# Altium schematic sheet ESP_SCH.SchDoc
size 381 x 177 mm
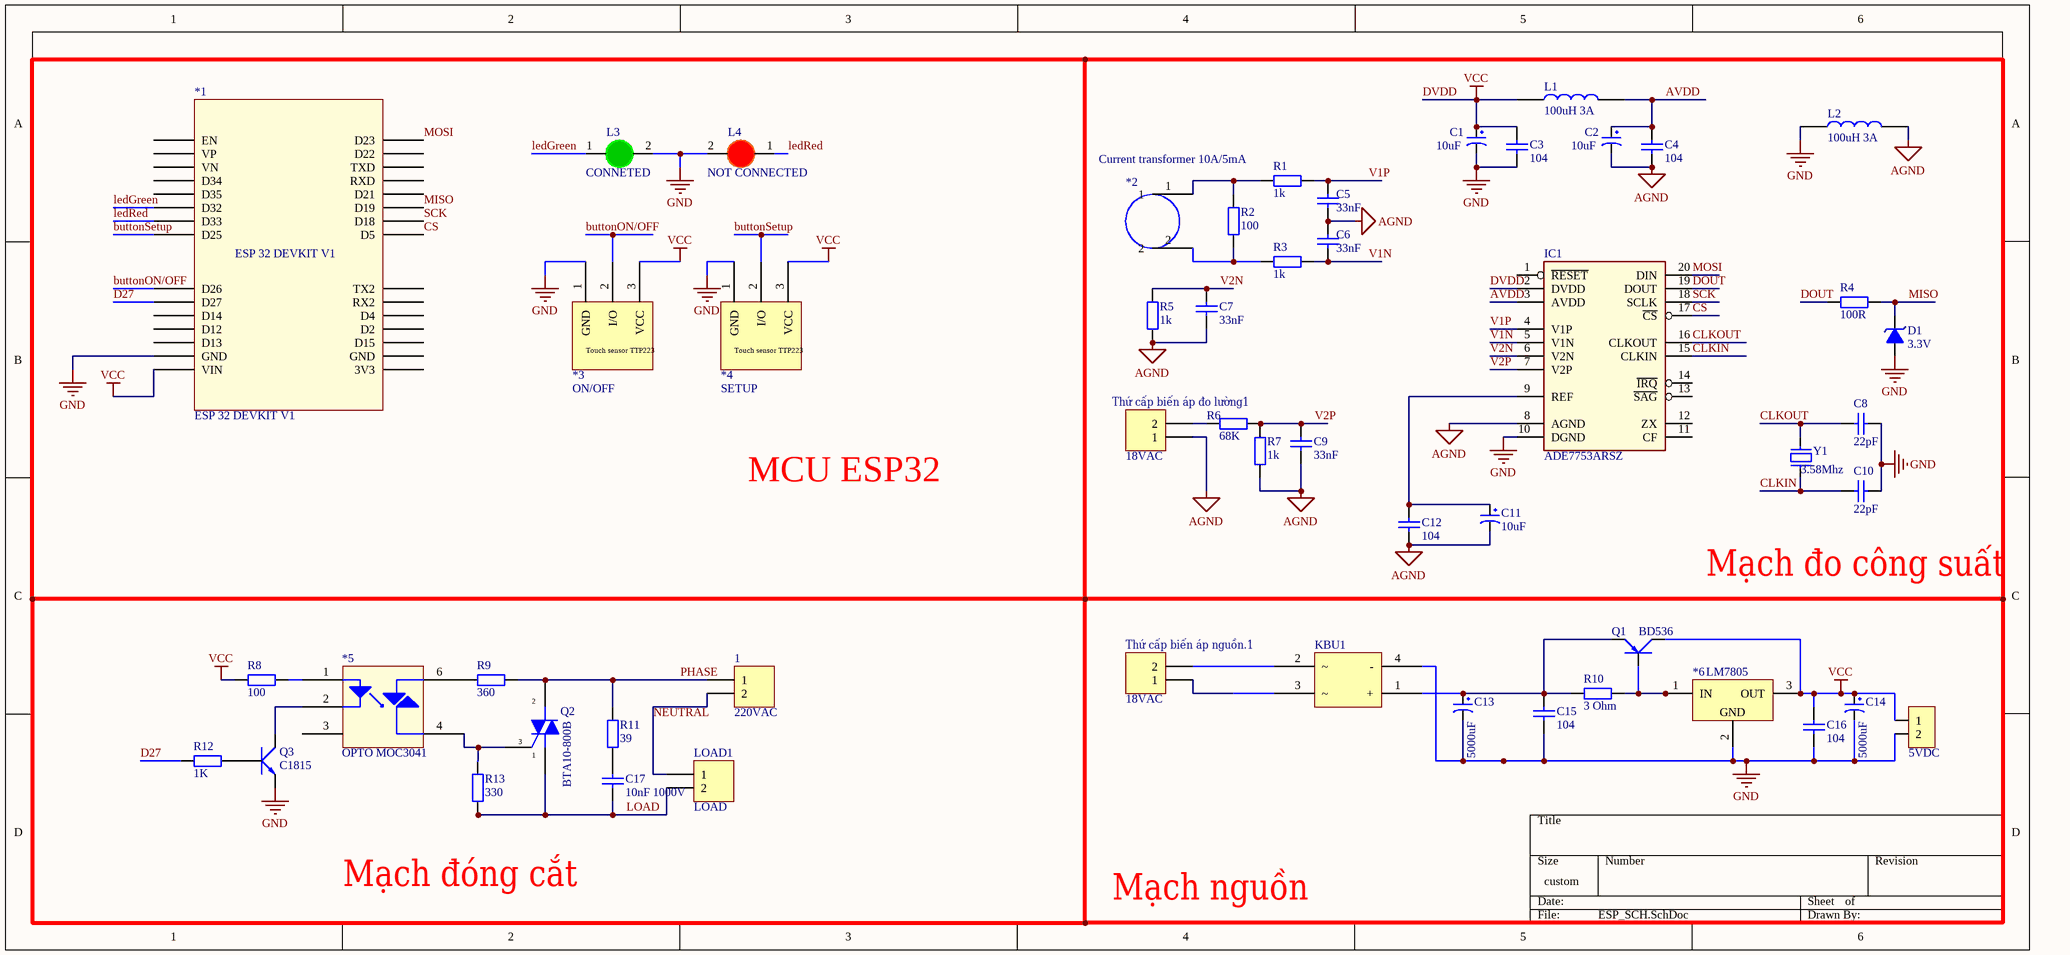
[diagram p0: ESP_SCH.SchDoc]

## Parts
1  220VAC  [KF127_2P]
*1  ESP 32 DEVKIT V1  [ESP32 DEVKIT V1]
*2  Current transformer 10A/5mA  [5A/5mA]
*3  ON/OFF  [TTP223]
*4  SETUP  [TTP223]
*5  OPTO MOC3041  [MOC3021]
*6  LM7805  [TO220]
C1  10uF  [tu hoa 4mm]
C2  10uF  [tu hoa 4mm]
C3  104  [tu gom]
C4  104  [tu gom]
C5  33nF  [tu gom]
C6  33nF  [tu gom]
C7  33nF  [tu gom]
C8  22pF  [tu gom]
C9  33nF  [tu gom]
C10  22pF  [tu gom]
C11  10uF  [tu hoa 4mm]
C12  104  [tu gom]
C13  5000uF  [tu hoa 8mm]
C14  5000uF  [tu hoa 8mm]
C15  104  [tu gom]
C16  104  [tu gom]
C17  10nF 1000V  [tu tantalum dip5.08]
D1  3.3V  [DIODE 0.5A]
IC1  ADE7753ARSZ  [ADE7753 dip]
JP1  5VDC  [JP 1x2 DT]
KBU1  10A 1000V  [DIODE CAU 10A CAM]  (value not drawn)
L1  100uH 3A  [CUON_CAM 100UH]
L2  100uH 3A  [CUON_CAM 100UH]
L3  CONNETED  [LED-3MM-GREEN]
L4  NOT CONNECTED  [LED-3MM-RED]
LOAD1  LOAD  [KF127_2P]
Q1  BD536  [to220]
Q2  BTA10-800B  [to220]
Q3  C1815  [TO92]
R1  1k  [Dien tro]
R2  100  [Dien tro]
R3  1k  [Dien tro]
R4  100R  [Dien tro]
R5  1k  [Dien tro]
R6  68K  [Dien tro]
R7  1k  [Dien tro]
R8  100  [Dien tro]
R9  360  [Dien tro]
R10  3 Ohm  [Dien tro]
R11  39  [Dien tro]
R12  1K  [Dien tro]
R13  330  [Dien tro]
Thứ_cấp_biến_áp_nguồn.1  18VAC  [KF127_2P]
Thứ_cấp_biến_áp_đo_lường1  18VAC  [KF127_2P]
Y1  3.58Mhz  [Thach Anh 2 chan cam]

## Nets
AGND: C2.2 C4.2 C5.2 C6.1 C7.2 C9.2 C11.2 C12.2 IC1.8(AGND) L2.2 R5.1 R7.1 Thứ_cấp_biến_áp_đo_lường1.1
DVDD: *1.15(VIN) *3.3(VCC) *4.3(VCC) *6.3(OUT) C1.1 C3.1 C14.1 C16.1 IC1.2(DVDD) JP1.1 L1.1 Q1.2(C) R8.2  [also labelled VCC]
GND: *1.14(GND) *3.1(GND) *4.1(GND) *6.2(GND) C1.2 C3.2 C8.1 C10.1 C13.2 C14.2 C15.2 C16.2 D1.1(A) IC1.10(DGND) JP1.2 KBU1.4(-) L2.1 L3.2(K) L4.2(K) Q3.1(E)
AVDD: C2.1 C4.1 IC1.3(AVDD) L1.2
buttonON/OFF: *1.9(D26) *3.2(I/O)
buttonSetup: *1.8(D25) *4.2(I/O)
CLKIN: C10.2 IC1.15(CLKIN) Y1.1
CLKOUT: C8.2 IC1.16(CLKOUT) Y1.2
CS: *1.23(D5) IC1.17(~{CS})
D27: *1.10(D27) R12.2
DOUT: IC1.19(DOUT) R4.2
ledGreen: *1.6(D32) L3.1(A)
ledRed: *1.7(D33) L4.1(A)
LOAD: C17.2 LOAD1.2 Q2.1(M1) R13.1
MISO: *1.25(D19) D1.2(K) R4.1
MOSI: *1.30(D23) IC1.20(DIN)
NEUTRAL: 1.2 LOAD1.1
PHASE: 1.1 Q2.2(M2) R9.2 R11.2
SCK: *1.24(D18) IC1.18(SCLK)
V1N: C6.2 IC1.5(V1N) R3.1
V1P: C5.1 IC1.4(V1P) R1.1
V2N: C7.1 IC1.6(V2N) R5.2
V2P: C9.1 IC1.7(V2P) R6.1 R7.2
Net*2_1: *2.1 R1.2 R2.2
Net*2_2: *2.2 R2.1 R3.2
Net*5_1: *5.1 R8.1
Net*5_2: *5.2 Q3.2(C)
Net*5_4: *5.4 Q2.3(G) R13.2
Net*5_6: *5.6 R9.1
Net*6_1: *6.1(IN) Q1.3(B) R10.1
NetC11_1: C11.1 C12.1 IC1.9(REF)
NetC13_1: C13.1 C15.1 KBU1.1(+) Q1.1(E) R10.2
NetC17_1: C17.1 R11.1
NetKBU1_2: KBU1.2 Thứ_cấp_biến_áp_nguồn.1.2
NetKBU1_3: KBU1.3 Thứ_cấp_biến_áp_nguồn.1.1
NetQ3_3: Q3.3(B) R12.1
NetR6_2: R6.2 Thứ_cấp_biến_áp_đo_lường1.2

Not connected (* = marked no-connect by the designer): *1 1(EN) 2(VP) 3(VN) 4(D34) 5(D35) 11(D14) 12(D12) 13(D13) 16(3V3) 17(GND) 18(D15) 19(D2) 20(D4) 21(RX2) 22(TX2) 26(D21) 27(RXD) 28(TXD) 29(D22); *5 3(5); IC1 1(~{RESET}) 11(CF) 12(ZX) 13(~{SAG}) 14(~{IRQ})

## Notes on the sheet
- MCU ESP32
- Mạch đo công suất
- (near Q2) 2
- (near Q2) 3
- (near Q2) 1
- Mạch đóng cắt
- Mạch nguồn
- (in symbol Touch sensor) Touch sensor TTP223

## Library data of the parts
1 LOAD1 Thứ_cấp_biến_áp_nguồn.1 Thứ_cấp_biến_áp_đo_lường1 = KF127 2P: Header, 2-Pin, pitch 5.08mm; MPN: KF127-2P; Solder: WAVE
*2 = Current transformer: Current transformer 5A/5mA
*3 *4 = Touch sensor
*5 = OPTO MOC3021
*6 = LM780x
C1 C2 C11 = Tu Hoa 10uF 25V 4x7: Cắm; So_Chan: 2; Ten_Linh_Kien: Tụ Hóa 10uF 25V 4x7MM; Don_Vi: Con; Ma_Hang: MH001349; Chung_Loai: Cắm; Kieu_Chan: *
C3 C4 C12 = Tu gom 104 50V: Cắm; So_Chan: 2; Ten_Linh_Kien: Tụ gốm 104 100nF 50V; Don_Vi: Con; Ma_Hang: MH004761; Chung_Loai: Cắm; Kieu_Chan: *
C5-C7 C9 = Tu gom 333 50V: Cắm; Don_Vi: Con; So_Chan: 2; Ten_Linh_Kien: Tụ gốm 333-33nF 50V; Ma_Hang: MH004774; Chung_Loai: Cắm; Kieu_Chan: *
C8 C10 = Tu gom 221 50V: Cắm; Don_Vi: Con; So_Chan: 2; Ten_Linh_Kien: Tụ gốm 220P 221 50V; Ma_Hang: MH004769; Chung_Loai: Cắm; Kieu_Chan: *
C13 C14 = Tu Hoa 1000uF 16V 8x20: Cắm; Don_Vi: Con; So_Chan: 2; Ten_Linh_Kien: Tụ Hóa 1000uF 16V 8x20MM; Ma_Hang: MH008300; Chung_Loai: Cắm; Kieu_Chan: *
C15 C16 = Tu gom 473 50V: Cắm; Don_Vi: Con; So_Chan: 2; Ten_Linh_Kien: Tụ gốm 473-0.047uF 50V; Ma_Hang: MH004778; Chung_Loai: Cắm; Kieu_Chan: *
C17 = Tu tantalum 10nF DIP5.08: Cắm; Don_Vi: Con; So_Chan: 2; Ten_Linh_Kien: Tụ tantalum 103-10nF DIP5.08 (sứ vàng)(10PCS); Ma_Hang: MH002105; Chung_Loai: Cắm; Kieu_Chan: *
D1 = Diode Zener 3.3V: Dán; Don_Vi: Con; Ma_Hang: MH002880; Ten_Linh_Kien: Diode Zener 1/2W 3.3V SMD1206 ZMM3.3; Kieu_Chan: *; Ghi_Chu: *; Chung_Loai: Dán
IC1 = ADE7753 SMD SOP20: Dán; Ten_Linh_Kien: ADE7753ARSZ SSOP20; Don_Vi: Con; Ma_Hang: MH004179; Ghi_Chu: *; Kieu_Chan: *; Chung_Loai: Dán
JP1 = JP 1x2 2.54 Duc Thang: Cắm; Ten_Linh_Kien: Jump Đơn Đực 2.54MM 1x40P Thẳng 11MM; Don_Vi: Con; Ma_Hang: MH000903; Ghi_Chu: *; Kieu_Chan: *; Chung_Loai: Cắm
KBU1 = Diode CAU 10A: Cắm; Ten_Linh_Kien: Diode Cầu 10A 1000V KBU1010; Don_Vi: Con; Ma_Hang: MH004295; Ghi_Chu: *; Kieu_Chan: *; Chung_Loai: cắm
L1 L2 = CUON CAM 100uH DIP: Dán; Don_Vi: Con; Ma_Hang: MH002209; Ten_Linh_Kien: Cuộn Cảm 100uH 3A 8x10MM; Chung_Loai: Dán; Ghi Chu: *; Kieu Chan: *
L3 = LED 3mm Xanh La: Cắm; Don_Vi: Con; Ma_Hang: MH001054; Ten_Linh_Kien: Led 3MM Phủ Xanh (10c); Ghi_Chu: *; Kieu_Chan: *; Chung_Loai: Cắm
L4 = LED 3mm Do: Cắm; Don_Vi: Con; Ma_Hang: MH003892; Ten_Linh_Kien: Led 3MM Phủ Đỏ (10c); Ghi_Chu: *; Kieu_Chan: *; Chung_Loai: Cắm
Q1 = A1015: PNP 600mW, ECB; Value: A1015
Q2 = BTA41-600BRG: TRIAC 600V 40A TOP3; Manufacturer: STMicroelectronics; BAPartNumber: VT-xxx; SOLD_BY: WAVE; Manufacturer Part Number: BTA41-600BRG; Value: BTA41-600B
Q3 = C1815: NPN transistor; Value: C9014
R1-R13 = Resistor: Cắm
Y1 = Thach Anh 2 chan Cam: Crystal For all Crystal 2pin.; Value: 4Mhz